# EAGLE schematic notch (EAGLE 7.5.0)
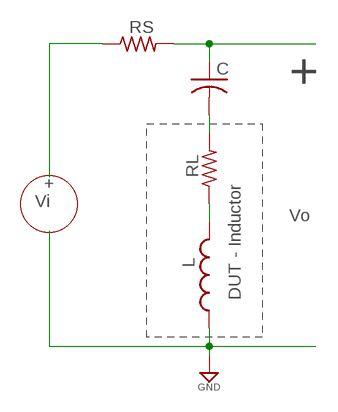
[diagram p0: schematic, sheet 1]

## Parts
C  C-US050-030X075  [C050-030X075]
L  L-USL0201  [L0201]
RL  R-US_0411/15  [0411/15]
RS  R-US_0411/15  [0411/15]

## Nets
GND: L.1
N$1: C.1 RS.2
N$2: C.2 RL.2
N$3: L.2 RL.1
N$6: RS.1

## Notes on the sheet
- +
- +
- Vi
- Vo
- DUT - Inductor

## Library data of the parts
C = rcl:C-US: CAPACITOR, American symbol
L = rcl:L-US: INDUCTOR, American symbol
RL RS = rcl:R-US_: RESISTOR, American symbol